# EAGLE design Fonte12V (EAGLE 9.6.2)
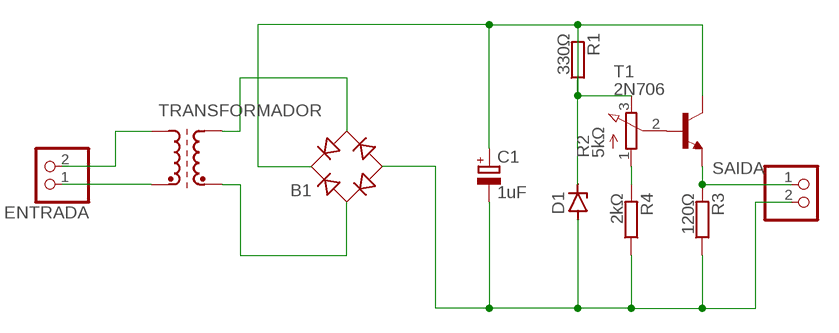
[diagram p0: schematic, sheet 1]

## Parts
B1  RB1A  [RB1A]
C1  1uF  CPOL-EUE2,5-6E  [E2,5-6E]
D1  ZENER-DIODEDO41Z10  [DO41Z10]
ENTRADA  PINHD-1X2  [1X02]
R1  330Ω  BVS  [BVS]
R2  5kΩ  3RP/1610N  [3RP/1610N]
R3  120Ω  BVS  [BVS]
R4  2kΩ  BVS  [BVS]
SAIDA  PINHD-1X2  [1X02]
T1  2N706  [TO18]
TRANSFORMADOR  SM-T4  [SM-T4]

## Nets
N$1: B1.+ C1.+ D1.C R1.1 R1.2 R2.3(E) T1.3(C)
N$2: B1.- C1.- D1.A R3.1 R4.1 SAIDA.2
N$3: ENTRADA.1 TRANSFORMADOR.2(E1)
N$4: R2.2(S) T1.2(B)
N$5: R2.1(A) R4.2
N$6: R3.2 SAIDA.1 T1.1(E)
N$7: B1.AC2 TRANSFORMADOR.5(A2)
N$8: ENTRADA.2 TRANSFORMADOR.1(A1)
N$9: B1.AC1 TRANSFORMADOR.4(E2)

## Library data of the parts
B1 = rectifier:RB1A: RECTIFIER 1 A
C1 = rcl:CPOL-EU: POLARIZED CAPACITOR, European symbol; SPICEPREFIX: C
D1 = diode:ZENER-DIODE: Z-Diode
ENTRADA SAIDA = pinhead:PINHD-1X2: PIN HEADER
R1 R3 R4 = resistor-shunt:BVS: SMD SHUNT RESISTOR; OC_FARNELL: unknown; OC_NEWARK: unknown
R2 = pot:3RP/1610N: 16mm Potentiometer one level Source: http://www.alphapotentiometers.net/html/16mm_pot_2.html
T1 = transistor:2N706: NPN TRANSISTOR
TRANSFORMADOR = inductor-neosid:SM-T4: TRANSFORMER SMD wideband transformer; OC_FARNELL: unknown; OC_NEWARK: unknown

## Board
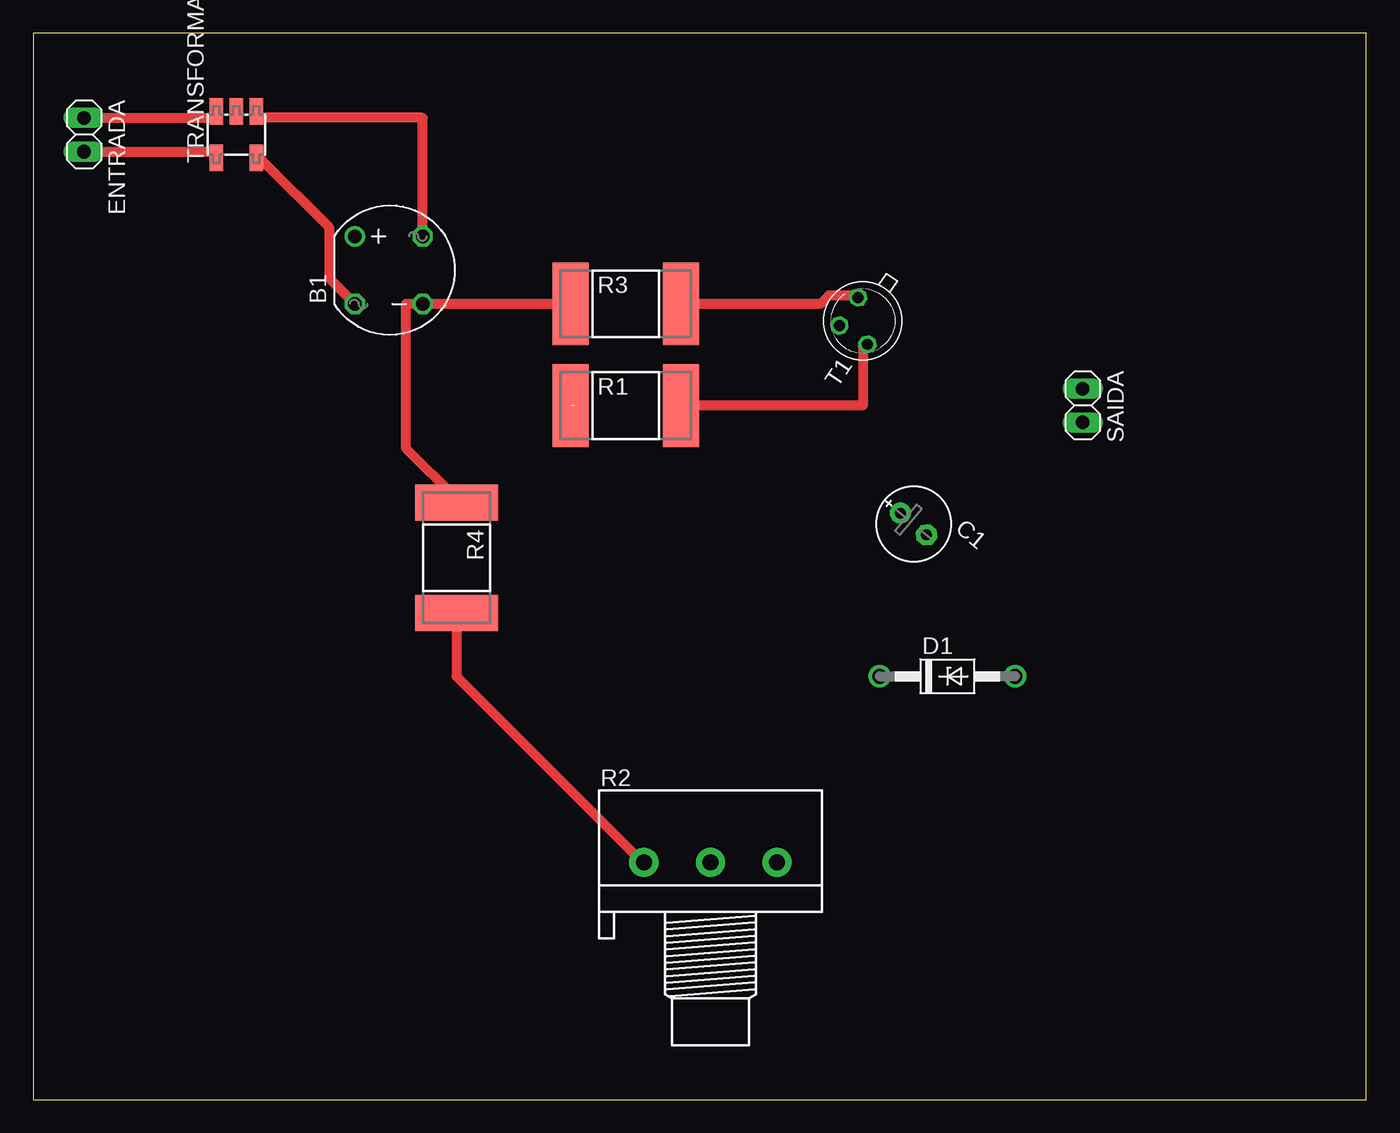
[diagram p1: board, top side]
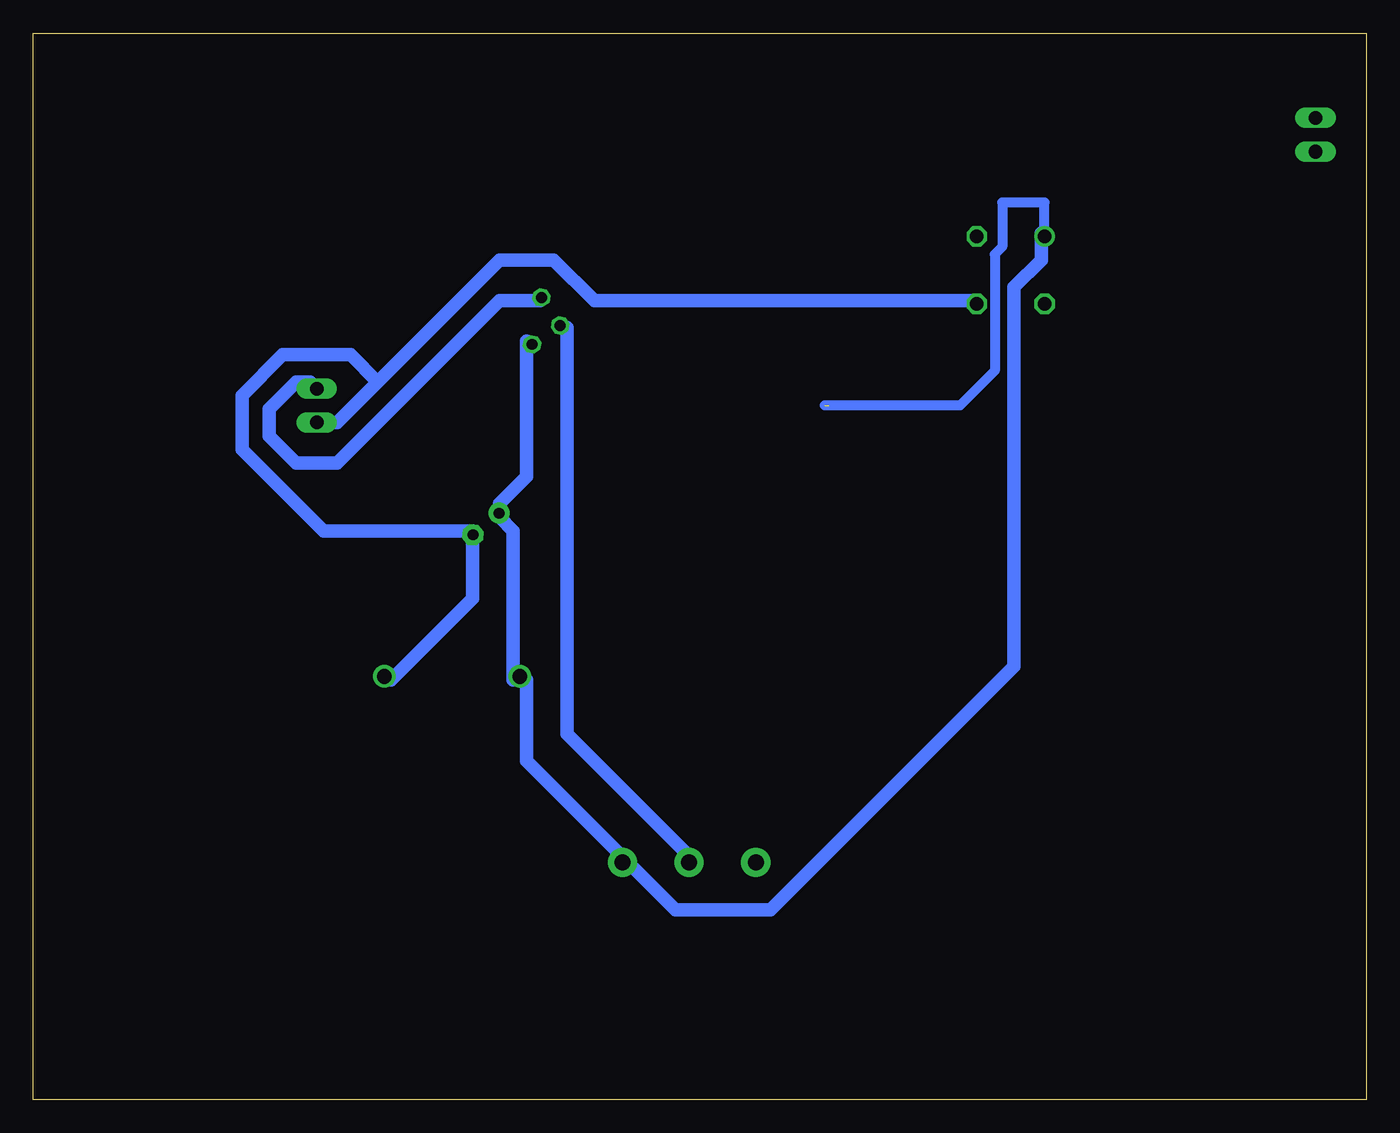
[diagram p2: board, bottom side, seen from below]

Size 100 x 80 mm. Coordinates in mm from the lower left corner, seen from the top.
Outline: 0,0 100,0 100,80 0,80 0,0
Copper layers (1*16): Top 0.035mm / dielectric 1.5mm / Bottom 0.035mm
Design rules "default *": minimum track width 25mil, minimum drill 0.35mm, track to track 25mil, track to pad 25mil, pad to pad 25mil, via to via 25mil, smd to smd 6mil, copper to edge 25mil, drill to drill 6mil, minimum pad ring 10mil, minimum via ring 8mil, stop-mask expansion 4mil, vias tented up to drill 0mil, thermal gap 10mil

### Footprints (pad centres in the part's own frame; a part is rotated, then mirrored left to right if it is on the bottom)
RB1A = drill 1.016: + -2.54,2.54 | drill 1.016 octagon: - 2.54,-2.54; AC1 2.54,2.54; AC2 -2.54,-2.54
E2,5-6E = drill 0.813 pad 1.575: + -1.27,0 | drill 0.813 pad 1.575 octagon: - 1.27,0
DO41Z10 = drill 1.118: A 5.08,0; C -5.08,0
1X02 = drill 1.016 long: 1 -1.27,0; 2 1.27,0
BVS = smd 2.7 x 6.2: 1 -4.14,0; 2 4.14,0
3RP/1610N = drill 1.2 pad 2.184: 1 -5,0; 2 0,0; 3 5,0
TO18 = drill 0.813 octagon: 1 -1.27,-1.27; 2 1.27,-1.27; 3 1.27,1.27
SM-T4 = smd 1 x 2: 1 -1.5,-1.75; 2 -1.5,1.75; 3 0,1.75; 4 1.5,1.75; 5 1.5,-1.75

### Placement (x,y rotation side)
B1  26.67,62.23 0 top
C1  66.04,43.18 320.4 top
D1  68.58,31.75 0 top
ENTRADA  3.81,72.39 270 top
R1  44.45,52.07 0 top
R2  50.8,17.78 0 top
R3  44.45,59.69 0 top
R4  31.75,40.64 270 top
SAIDA  78.74,52.07 270 top
T1  62.23,58.42 236.3 top
TRANSFORMADOR  15.24,72.39 0 top

### Tracks (layer width: path | path; a pad name or v marks a point on that pad's centre or on a via)
N$1  (1 unrouted)
  Top 0.762: R1.2 62.23,52.07 62.23,56.52 T1.3
  Bottom 0.762: B1.+ 24.13,67.31 27.3,67.31 27.3,63.98 27.86,63.42 27.86,54.69 30.48,52.07 40.64,52.07
  Bottom 1.016: T1.3 62.99,56.9 62.99,46.74 65.02,44.7 C1.+ 65.02,43.69 64.01,42.67 64.01,31.5 D1.C 62.99,31.5 62.99,25.4 55.88,18.29 R2.3 54.86,17.27 51.82,14.22 44.7,14.22 26.42,32.51 26.42,60.96 24.38,62.99 24.38,65.02 B1.+
N$2
  Top 0.762: R4.1 31.75,45.09 27.94,48.9 27.94,59.69 B1.- R3.1
  Bottom 1.016: D1.A 73.15,31.5 67.06,37.59 67.06,41.66 C1.- 67.06,42.67 78.23,42.67 84.33,48.77 84.33,52.83 81.28,55.88 76.2,55.88 74.17,53.85 | 74.17,53.85 77.22,50.8 SAIDA.2 | 74.17,53.85 65.02,62.99 60.96,62.99 57.91,59.94 29.46,59.94 B1.-
N$3
  Top 0.762: ENTRADA.1 13.34,73.66 TRANSFORMADOR.2
N$4
  Bottom 1.016: T1.2 59.94,57.91 59.94,27.43 50.8,18.29 R2.2
N$5
  Top 0.762: R4.2 31.75,31.75 45.72,17.78 R2.1
N$6
  Top 0.762: R3.2 59.05,59.69 59.69,60.33 61.59,60.33 T1.1
  Bottom 1.016: T1.1 61.98,59.94 65.02,59.94 77.22,47.75 80.26,47.75 82.3,49.78 82.3,51.82 80.26,53.85 79.25,53.85 SAIDA.1
N$7
  Top 0.762: B1.AC2 22.23,61.59 22.23,65.41 17.14,70.48 TRANSFORMADOR.5
N$8
  Top 0.762: ENTRADA.2 13.34,71.12 TRANSFORMADOR.1
N$9
  Top 0.762: B1.AC1 29.21,73.66 17.14,73.66 TRANSFORMADOR.4